# Altium schematic sheet Sheet1_FL.SchDoc
size A
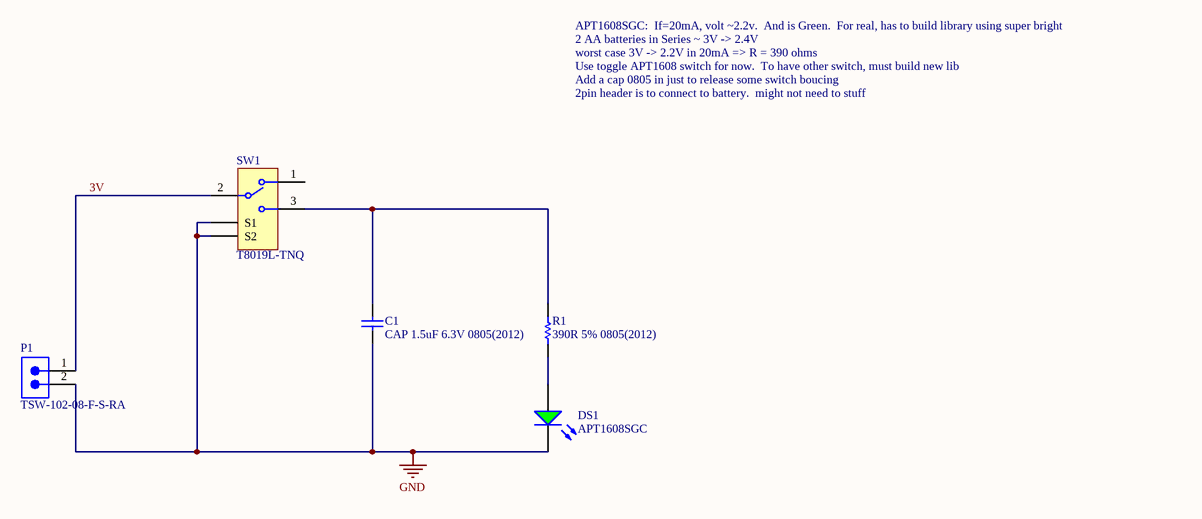
[diagram p0: Sheet1_FL.SchDoc]

## Parts
C1  CAP 1.5uF 6.3V 0805(2012)  [CAPC0805(2012)100_M]
DS1  APT1608SGC  [KING-APT1608SGC_V]
P1  TSW-102-08-F-S-RA  [SMTC-TSW-102-08-X-S-RA]
R1  390R 5% 0805(2012)  [RESC0805(2012)_N]
SW1  T8019L-TNQ  [SALE-T8019L-5_V]

## Nets
GND: C1.1 DS1.2(K) P1.2 SW1.S1 SW1.S2
3V: P1.1 SW1.2
NetC1_2: C1.2 R1.2 SW1.3
NetDS1_1: DS1.1(A) R1.1

Not connected (* = marked no-connect by the designer): SW1 1

## Notes on the sheet
- APT1608SGC:  If=20mA, volt ~2.2v.  And is Green.  For real, has to build library using super bright
- 2 AA batteries in Series ~ 3V -> 2.4V
- worst case 3V -> 2.2V in 20mA => R = 390 ohms
- Use toggle APT1608 switch for now.  To have other switch, must build new lib
- Add a cap 0805 in just to release some switch boucing
- 2pin header is to connect to battery.  might not need to stuff

## Library data of the parts
C1 = CMP-1036-04785-1: CAP 1.5uF 6.3V ±20% 0805 (2012 Metric) Thickness 1mm SMD; Case-EIA: 0805; Tolerance: Â±20%; Case-Metric: 2012; Max Thickness: 1 mm; Technology: SMT; Value: 1.5uF; Rated Voltage: 6.3 V
DS1 = CMP-2000-05789-1: Super Bright Green LED, 62.5 mW, 25 mA, -40 to 85 degC, 2-Pin SMD, RoHS, Tape and Reel; Manufacturer: Kingbright; Online Catalog: 0603RectanglewithFlatTopChipLEDs; Wavelength - Dominant: 568nm; Wavelength - Peak: 565nm; Voltage - Forward (Vf) (Typ): 2.2V; Lens Type: Clear; Other Names: 754-1121-2; Millicandela Rating: 15mcd; Catalog Drawings: APT1608SeriesTop / APT1608SeriesSide; Lens Style/Size: RectanglewithFlatTop,1.2mmx0.8mm; Current - Test: 20mA; 3D Model: APT1608x.sldprt / APT1608x.pro / APT1608x.igs / APT1608x.stp; Viewing Angle: 120°; Package / Case: 0603(1608Metric); Category: Optoelectronics; Package Description: 2-Pin Surface Mount Device, Body 0.8 x 1.6 mm; Mounting Type: SurfaceMount; Color: Green; Height: 0.75mm; Datasheet Version: Rev. 16B, 02/2012; Family: LEDIndication-Discrete; Manufacturer URL: http://www.kingbright.com/; Package Reference: APT1608SGC; Datasheet URL: https://datasheet.ciiva.com/2113/apt1608sgc-2113808.pdf; Mounting Technology: SurfaceMount; Packaging: Tape&Reel(TR); Standard Package: 2,000; Size / Dimension: 1.60mmLx0.80mmW
P1 = CMP-1024-00321-1: 0.025" SQ Post Header, Through-hole, Right Angle, -55 to 125 degC, 2.54 mm Pitch, 2-Pin, Male, RoHS; Manufacturer: Samtec; Pitch: 2.54 mm; PackageReference: TSW-102-08-X-S-RA; Mounting Technology: Through-hole; DatasheetVersion: F-214; ComponentLink2Description: Datasheet; ComponentLink2URL: http://www.samtec.com/documents/webfiles/pdf/TSW_TH.PDF; PartNumber: TSW-102-08-F-S-RA; Orientation: Right Angle; ComponentLink3URL: http://www.samtec.com/documents/webfiles/cpdf/TSW-XXX-XX-XXX-X-XX-XXX-MKT.pdf; PackageDescription: .025[0.64] SQ. Post Terminal Strip Assembly; ComponentLink1URL: http://www.samtec.com; PackageVersion: DM, 8/1988; ComponentLink3Description: Package Specification; Temperature Range: -55 to 125 degC; ComponentLink1Description: Manufacturer URL; RoHS: True
R1 = CMP-1013-00064-1: 390R 0.125W 5% 0805 (2012 Metric)  SMD; Case-EIA: 0805; Value: 390.00 Ohm; Case-Metric: 2012; Power: 0.125 W; Tolerance: 5 %; Technology: SMT
SW1 = CMP-0428-00001-1: Toggle Switch, SPDT, Through Hole, 3 Terminals; Manufacturer: Salecom Electronics; Mechanical Life: 50,000 cycles; ComponentLink2Description: Datasheet; PackageReference: T8019L; ComponentLink1Description: Manufacturer URL; PackageDescription: Toggle Switch, 3 Leads, Vertical Right Angle; PartNumber: T8019L-TNQ; ComponentLink1URL: http://www.salecom.com/; DatasheetVersion: Jul-12; ComponentLink2URL: http://www.salecom.com/pdf/toggle%20switch_T80-T.pdf; Operating Temperature: -30 to +85 degC; Mounting Technology: Through Hole